# EasyEDA schematic Schematic.json
TITLE: Sheet_1; REV: 1.0; Date: 2026-02-11; Sheet: 1/1; Drawn By: samarth_58; Company: Your Company
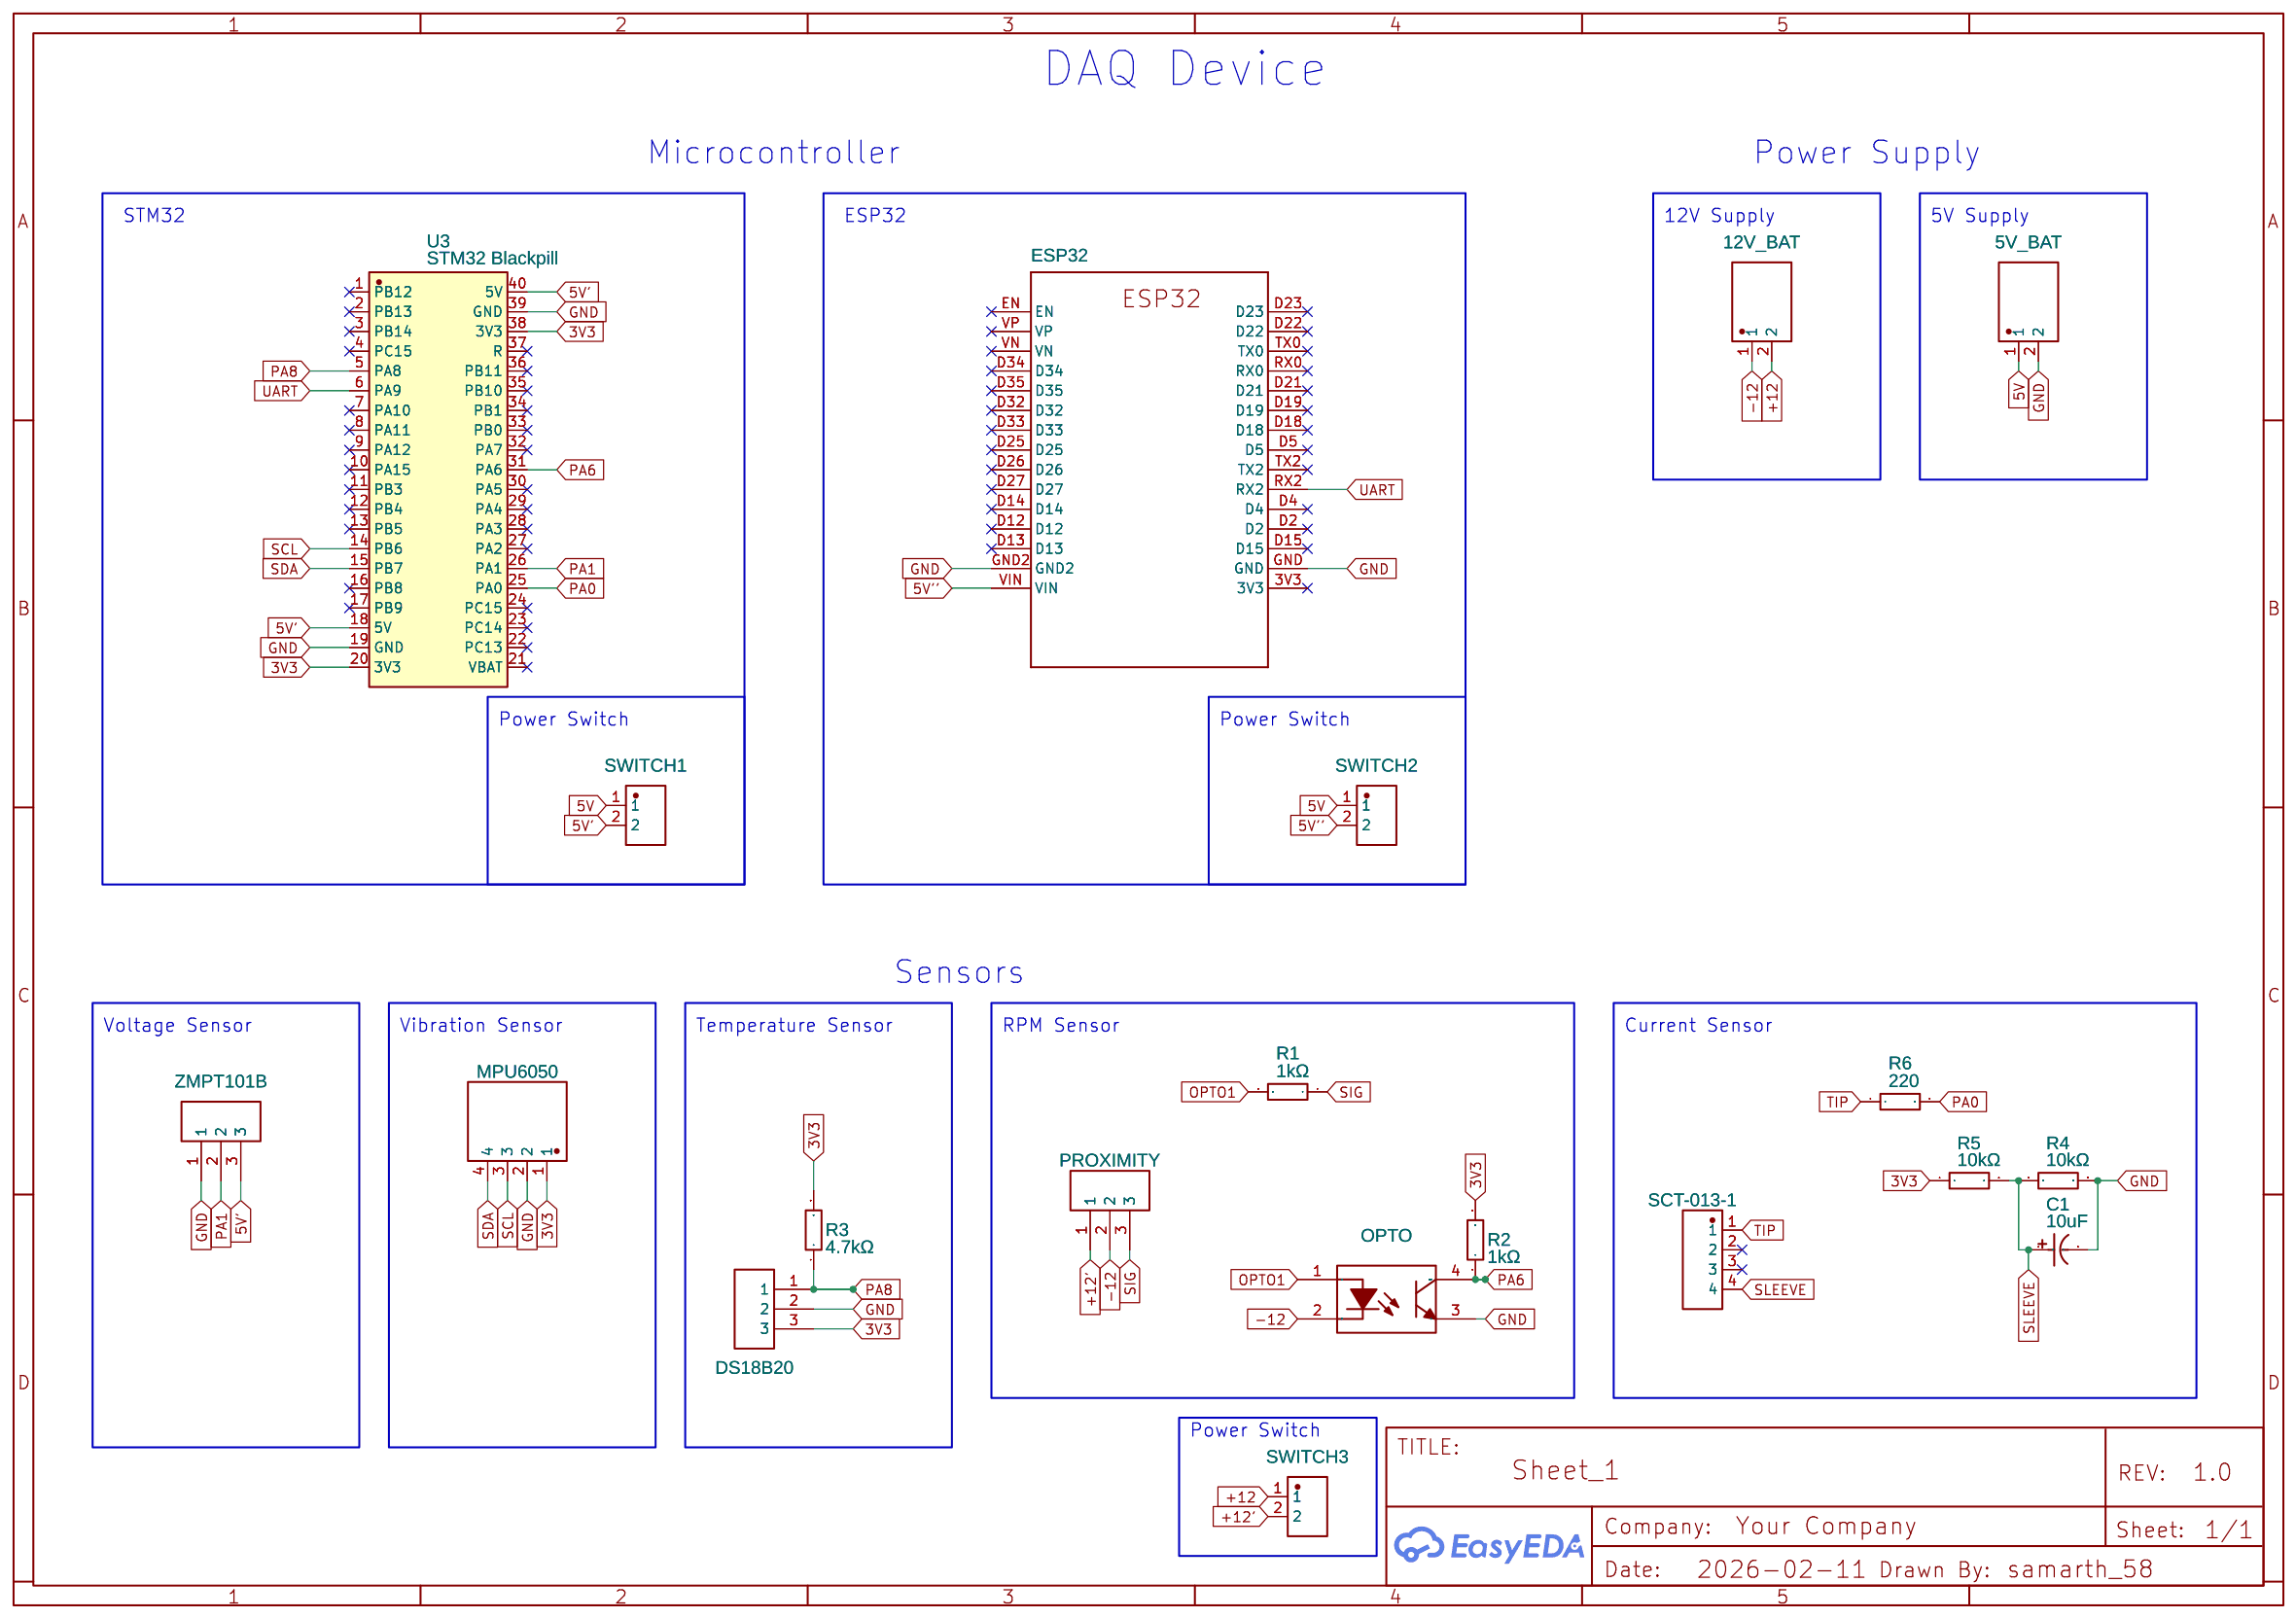
[diagram p0: schematic sheet]

## Parts
2  ESP32  [ESP32-DEVKITV1_ESP32-DEVKITV1]
5V_BAT  B2B-XH-A (LF)(SN)  [CONN-TH_B2B-XH-A-LF-SN]
12V_BAT  B2B-XH-A (LF)(SN)  [CONN-TH_B2B-XH-A-LF-SN]
C1  10uF  [CAP-TH_BD6.3-P2.50-D1.0-FD]
DS18B20  B3B-XH-A(LF)(SN)  [CONN-TH_3P-P2.50_A2501WV2-3P]
MPU6050  B4B-XH-A(LF)(SN)  [CONN-TH_B4B-XH-A-LF-SN]
OPTO  PC817C_C20612594  [DIP-4_L6.5-W4.6-P2.54-LS7.6-BL]
PROXIMITY  B3B-XH-A(LF)(SN)  [CONN-TH_3P-P2.50_A2501WV2-3P]
R1  1kΩ  [RES-TH_BD2.5-L6.5-P10.50-D0.6]
R2  1kΩ  [RES-TH_BD2.5-L6.5-P10.50-D0.6]
R3  4.7kΩ  [RES-TH_BD2.3-L6.5-P10.50-D0.5]
R4  10kΩ  [RES-TH_BD2.5-L6.5-P10.50-D0.6]
R5  10kΩ  [RES-TH_BD2.5-L6.5-P10.50-D0.6]
R6  220  [RES-TH_BD2.2-L6.5-P10.50-D0.6]
SCT-013-1  PM2.54-1*4  [HDR-TH_4P-P2.54-V-F]
SWITCH1  HX PH254-01-02-Z-L11.5 MALE HEADER CONNECTOR  [HDR-TH_2P-P2.54-V-M]
SWITCH2  HX PH254-01-02-Z-L11.5 MALE HEADER CONNECTOR  [HDR-TH_2P-P2.54-V-M]
SWITCH3  HX PH254-01-02-Z-L11.5 MALE HEADER CONNECTOR  [HDR-TH_2P-P2.54-V-M]
U3  STM32 Blackpill  [STM32F MODULE (BLACKPILL)]
ZMPT101B  B3B-XH-A(LF)(SN)  [CONN-TH_3P-P2.50_A2501WV2-3P]

## Library data of the parts
2 = ESP32-DEVKIT-V1-30PIN: Contributor: Dayz221
5V_BAT 12V_BAT = B2B-XH-A (LF)(SN): Contributor: LCSC; Supplier: LCSC; Supplier Part: C158012; Manufacturer: JST; Manufacturer Part: B2B-XH-A(LF)(SN); JLCPCB Part Class: Extended Part
C1 = 100YXF10MEFCT16.3X11: Supplier: LCSC; Manufacturer: Rubycon(红宝石); Supplier Part: C88779; JLCPCB Part Class: Extended Part
DS18B20 PROXIMITY ZMPT101B = B3B-XH-A(LF)(SN): Contributor: LCSC; Supplier: LCSC; Supplier Part: C144394; Manufacturer: JST; JLCPCB Part Class: Extended Part
MPU6050 = B4B-XH-A(LF)(SN): Contributor: LCSC; Supplier: LCSC; Supplier Part: C144395; Manufacturer: JST; JLCPCB Part Class: Extended Part
OPTO = PC817C_C20612594: Supplier: LCSC; Supplier Part: C20612594; Manufacturer: AOTE(奥特); Manufacturer Part: PC817C; Contributor: lcsc; JLCPCB Part Class: Extended Part
R1 R2 R4 R5 = MBB02070C1001FCT00: Contributor: lcsc; Supplier: LCSC; Supplier Part: C1364389; Manufacturer: VISHAY(威世); JLCPCB Part Class: Extended Part
R3 = MF1/4W-4.7KΩ±1% T52: Contributor: LCSC; Supplier: LCSC; Supplier Part: C119339; Manufacturer: CCO(千志电子); Manufacturer Part: MF1/4W-4.7KΩ±1% T; JLCPCB Part Class: Extended Part
R6 = MF1/4W-220__1% T: Type:Metal Film Resistors Resistance: Tolerance:±1% Tolerance:±1% Overload Voltage (Max):250V Power(Watts):250mW Temperature Coefficient:±100ppm/℃ Temperature Coefficient:±100ppm/℃ Operating Temperature Range:-55℃~+155℃ Operating Temperature Range:-55℃~+1; Symbol: MF1/4W-220Ω±1%; Device: MF1/4W-220Ω±1% T; LCSC Part Name: 220Ω ±1% 250mW 金属膜电阻; Supplier Part: C127220; Manufacturer: CCO(千志电子); Manufacturer Part: MF1/4W-220Ω±1% T; Supplier Footprint: 插件,D2.3xL6.5mm; JLCPCB Part Class: Extended Part; Datasheet: https://atta.szlcsc.com/upload/public/pdf/source/20190910/C427326_62A6D058BC0FF74963A2F22379CA06CE.pdf; Supplier: LCSC; Add into BOM: yes; Convert to PCB: yes; Type: Metal Film Resistors; Tolerance: ±1%; Overload Voltage (Max): 250V; Power(Watts): 250mW; Temperature Coefficient: ±100ppm/℃; Operating Temperature Range: -55℃~+155℃; Comment: 220Ω
SCT-013-1 = PM2.54-1*4: Contributor: evgeny.tzurckov; Supplier: LCSC; Supplier Part: C5116530; Manufacturer: ZHOURI(洲日); JLCPCB Part Class: Extended Part
SWITCH1-SWITCH3 = HX PH254-01-02-Z-L11.5 MALE HEADER CONNECTOR: Supplier: LCSC; Supplier Part: C52016390; Manufacturer: hanxia(韩下); Manufacturer Part: HX PH254-01-02-Z-L11.5 male header connector; JLCPCB Part Class: Extended Part; Contributor: lcsc
U3 = STM32 Blackpill: Contributor: kevin.worsfold

## Nets
3V3: DS18B20.3 MPU6050.1 R2.2 R3.2 R5.1 U3.20(3V3) U3.38(3V3)
5V: 5V_BAT.1 SWITCH1.1 SWITCH2.1
5V': SWITCH1.2 U3.18(5V) U3.40(5V) ZMPT101B.3
5V'': 2.VIN SWITCH2.2
GND: 2.GND 2.GND2 5V_BAT.2 C1.2 DS18B20.2 MPU6050.2 OPTO.3(E) R4.2 U3.19(GND) U3.39(GND) ZMPT101B.1
+12: 12V_BAT.2 SWITCH3.1
+12': PROXIMITY.1 SWITCH3.2
-12: 12V_BAT.1 OPTO.2(C) PROXIMITY.2
OPTO1: OPTO.1(A) R1.2
PA0: R6.2 U3.25(PA0)
PA1: U3.26(PA1) ZMPT101B.2
PA6: OPTO.4(COLLECTOR) R2.1 U3.31(PA6)
PA8: DS18B20.1 R3.1 U3.5(PA8)
SCL: MPU6050.3 U3.14(PB6)
SDA: MPU6050.4 U3.15(PB7)
SIG: PROXIMITY.3 R1.1
SLEEVE: C1.1 R4.1 R5.2 SCT-013-1.4
TIP: R6.1 SCT-013-1.1
UART: 2.RX2 U3.6(PA9)

Not connected (* = marked no-connect by the designer): 2 3V3* D2* D4* D5* D12* D13* D14* D15* D18* D19* D21* D22* D23* D25* D26* D27* D32* D33* D34* D35* EN* RX0* TX0* TX2* VN* VP*; SCT-013-1 2* 3*; U3 1(PB12)* 2(PB13)* 3(PB14)* 4(PC15)* 7(PA10)* 8(PA11)* 9(PA12)* 10(PA15)* 11(PB3)* 12(PB4)* 13(PB5)* 16(PB8)* 17(PB9)* 21(VBAT)* 22(PC13)* 23(PC14)* 24(PC15)* 27(PA2)* 28(PA3)* 29(PA4)* 30(PA5)* 32(PA7)* 33(PB0)* 34(PB1)* 35(PB10)* 36(PB11)* 37(R)*

## Notes on the sheet
- DAQ Device
- Microcontroller
- Power Supply
- STM32
- ESP32
- 12V Supply
- 5V Supply
- Power Switch
- Power Switch
- Sensors
- Voltage Sensor
- Vibration Sensor
- Temperature Sensor
- RPM Sensor
- Current Sensor
- Power Switch
